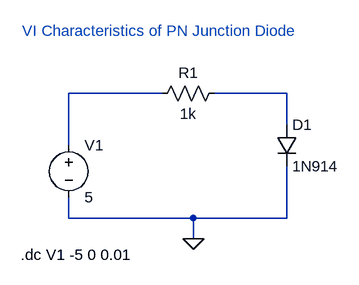
[diagram p0: schematic 1 VI Characteristics of PN Junction Diode.asc]
1 VI Characteristics of PN Junction Diode.asc, the LTspice schematic file:
Version 4
SHEET 1 880 680
WIRE 80 -64 -64 -64
WIRE 272 -64 160 -64
WIRE 272 -16 272 -64
WIRE -64 16 -64 -64
WIRE -64 128 -64 96
WIRE 128 128 -64 128
WIRE 272 128 272 48
WIRE 272 128 128 128
WIRE 128 160 128 128
FLAG 128 160 0
SYMBOL diode 256 -16 R0
SYMATTR InstName D1
SYMATTR Value 1N914
SYMBOL res 176 -80 R90
WINDOW 0 0 56 VBottom 2
WINDOW 3 32 56 VTop 2
SYMATTR InstName R1
SYMATTR Value 1k
SYMBOL voltage -64 0 R0
WINDOW 123 0 0 Left 0
WINDOW 39 0 0 Left 0
SYMATTR InstName V1
SYMATTR Value 5
TEXT -136 -160 Left 2 ;VI Characteristics of PN Junction Diode
TEXT -138 184 Left 2 !.dc V1 -5 0 0.01

The netlist it stands for:
* 1 VI Characteristics of PN Junction Diode.asc
D1 N002 0 1N914
R1 N002 N001 1k
V1 N001 0 5
.model D D
.lib standard.dio
* VI Characteristics of PN Junction Diode
.dc V1 -5 0 0.01
.backanno
.end